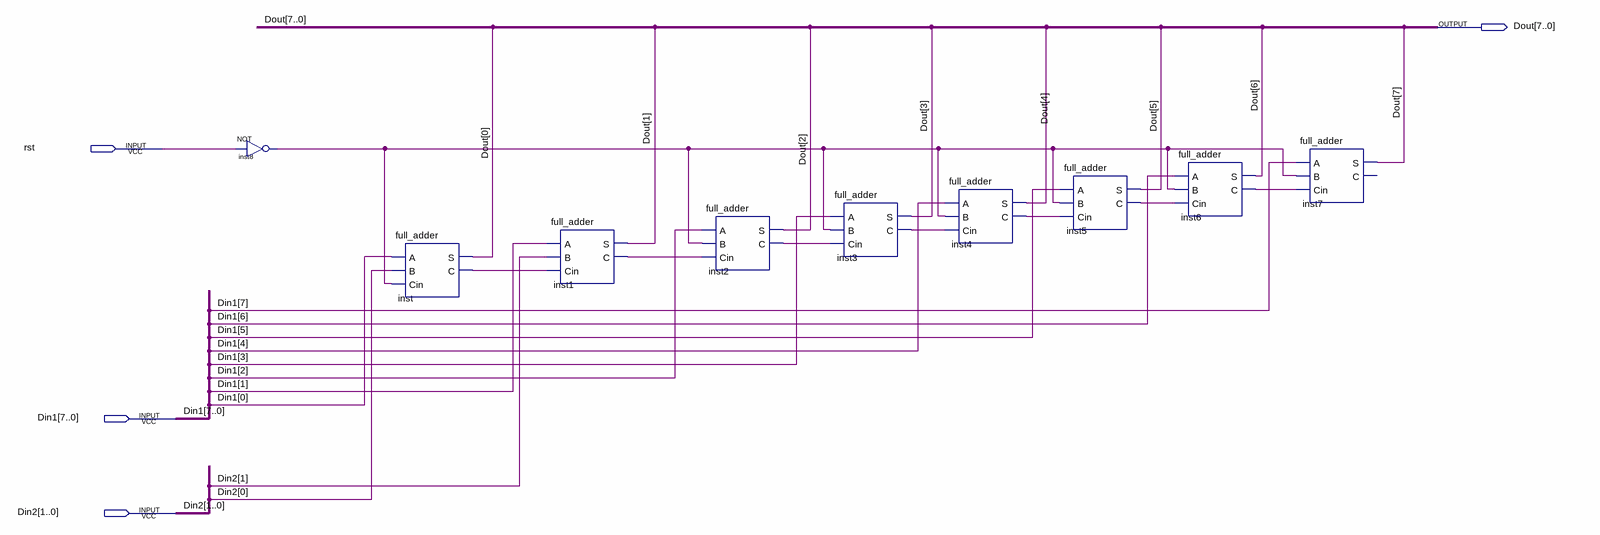
[diagram p0: schematic sheet]
// Quartus schematic adder_8bit_2bit.bdf as structural Verilog: 9 symbols, 4 pins
module adder_8bit_2bit (
  input  rst,
  input  [7:0] Din1,
  input  [1:0] Din2,
  output [7:0] Dout
);

  wire inst1_c, inst2_c, inst3_c, inst4_c, inst5_c, inst6_c, inst8_out, inst_c;

  not inst8 (inst8_out, rst);
  full_adder inst (.A(Din1[0]), .B(Din2[0]), .Cin(inst8_out), .S(Dout[0]), .C(inst_c));
  full_adder inst1 (.A(Din1[1]), .B(Din2[1]), .Cin(inst_c), .S(Dout[1]), .C(inst1_c));
  full_adder inst2 (.A(Din1[2]), .B(inst8_out), .Cin(inst1_c), .S(Dout[2]), .C(inst2_c));
  full_adder inst3 (.A(Din1[3]), .B(inst8_out), .Cin(inst2_c), .S(Dout[3]), .C(inst3_c));
  full_adder inst4 (.A(Din1[4]), .B(inst8_out), .Cin(inst3_c), .S(Dout[4]), .C(inst4_c));
  full_adder inst5 (.A(Din1[5]), .B(inst8_out), .Cin(inst4_c), .S(Dout[5]), .C(inst5_c));
  full_adder inst6 (.A(Din1[6]), .B(inst8_out), .Cin(inst5_c), .S(Dout[6]), .C(inst6_c));
  full_adder inst7 (.A(Din1[7]), .B(inst8_out), .Cin(inst6_c), .S(Dout[7]));  // open: C
endmodule
